# Altium schematic sheet SoftPowerSwitch.SchDoc
size A4; SheetNumber: 7; SheetTotal: 10
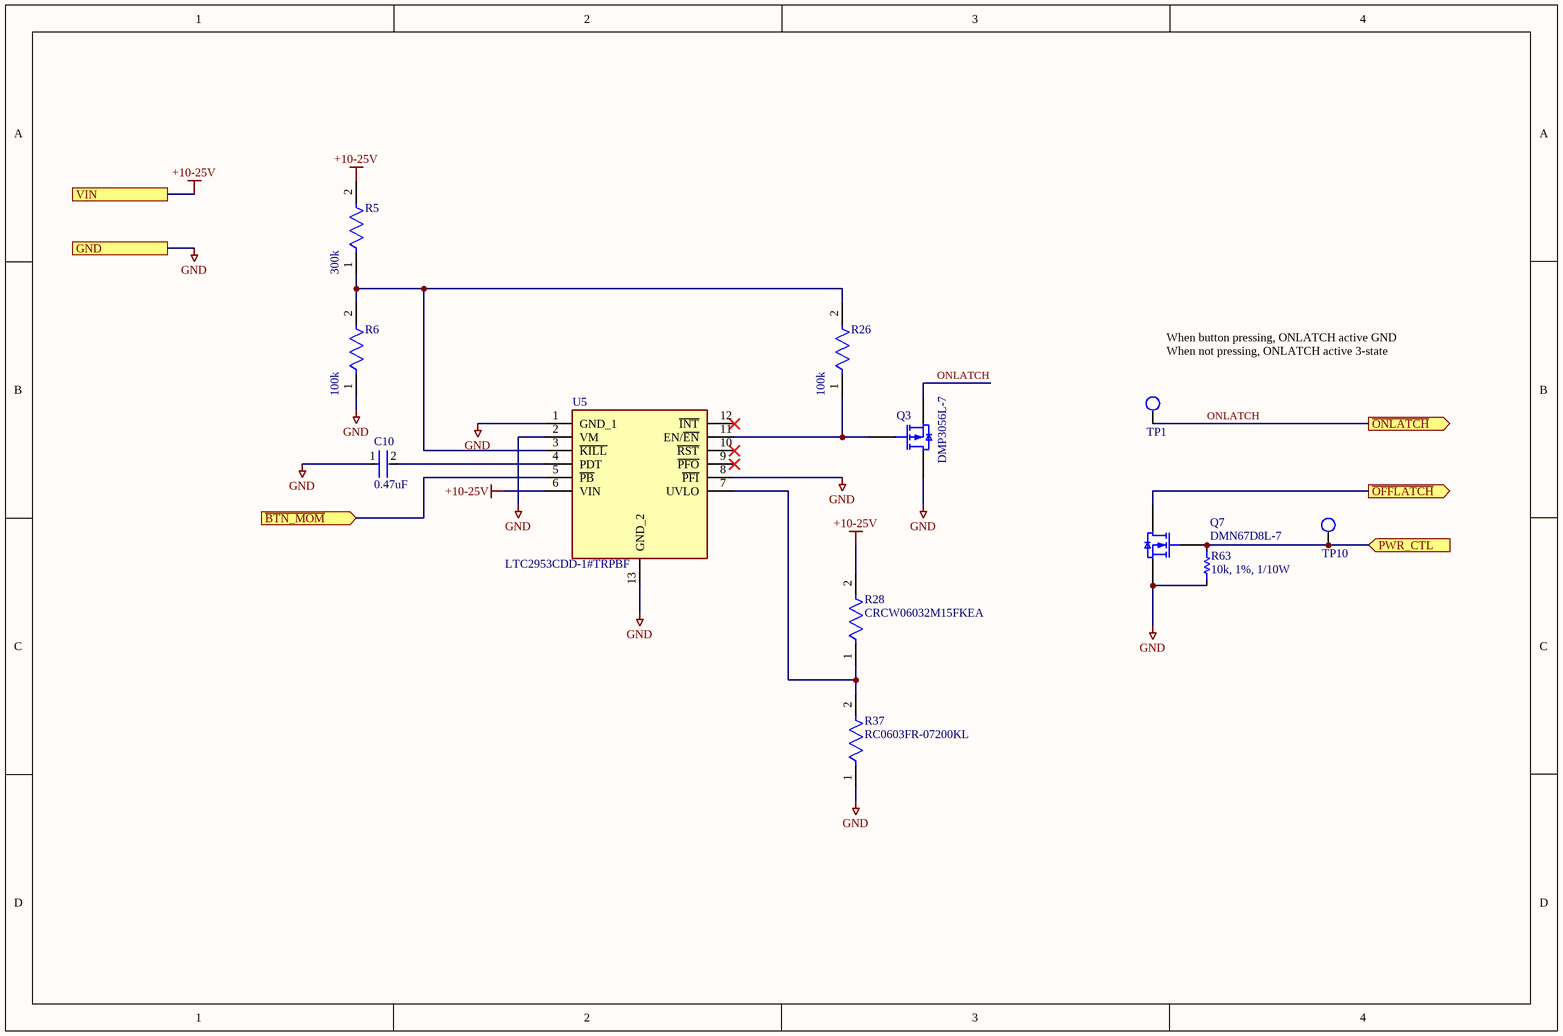
[diagram p0: SoftPowerSwitch.SchDoc]

## Parts
C10  0.47uF  [FP-C0603C-CF-MFG]
Q3  DMP3056L-7  [SOT23-3]
Q7  DMN67D8L-7  [SOT23-3]
R5  300k  [FP-ERA3A-IPC_C]
R6  100k  [FP-RC0603-0_55-MFG]
R26  100k  [FP-RC0603-0_55-MFG]
R28  CRCW06032M15FKEA  [FP-CRCW0603-e3-IPC_A]
R37  RC0603FR-07200KL  [FP-RC0603-0_55-IPC_B]
R63  10k, 1%, 1/10W  [0603]
TP1  2mm  [TEST POINT 40 Mil]  (value not drawn)  (no BOM)
TP10  2mm  [TEST POINT 40 Mil]  (value not drawn)  (no BOM)
U5  LTC2953CDD-1#TRPBF  [SON45P300X300X80-13N-D]

## Ports
GND, PWR_CTL (in), VIN, ~{BTN_MOM} (in), ~{OFFLATCH} (out), ~{ONLATCH} (out)

## Nets
+10-25V: R5.2 R28.2 U5.6(VIN) ; port VIN
GND: C10.1 Q3.3(D) Q7.2(S) R6.1 R37.1 R63.1 U5.1(GND_1) U5.2(VM) U5.8(~{PFI}) U5.13(GND_2) ; port GND
~{BTN_MOM}: U5.5(~{PB}) ; port ~{BTN_MOM}
~{OFFLATCH}: Q7.3(D) ; port ~{OFFLATCH}
ONLATCH: Q3.2(S) TP1.1(TP) ; port ~{ONLATCH}
PWR_CTL: Q7.1(G) R63.2 TP10.1(TP) ; port PWR_CTL
NetC10_2: C10.2 U5.4(PDT)
NetQ3_1: Q3.1(G) R26.1 U5.11(EN/~{EN})
NetR5_1: R5.1 R6.2 R26.2 U5.3(~{KILL})
NetR28_1: R28.1 R37.2 U5.7(UVLO)

Not connected (* = marked no-connect by the designer): U5 9(~{PFO})* 10(~{RST})* 12(~{INT})*

## Notes on the sheet
- When button pressing, ONLATCH active GND
  When not pressing, ONLATCH active 3-state

## Library data of the parts
C10 = CMP-2006-02280-3: CAP CER 0.47UF 16V 10% X5R 0603; Manufacturer Part Number: C0603C474K4PACTU; Manufacturer: KEMET; Material: Ceramic; Tolerance: 0.1; Temperature Coefficient: 30ppm/°C; Capacitance: 0.47 μF; Automotive Grade: Grade 1; Value: 0.47 μF; Temperature Range High: +125°C; ComponentLink2Description: Datasheet; Temperature Range Low: -55°C; Temperature: -55°C to +125°C; Automotive: Yes; Package: C0603C-CF; Device Class L1: Passive Components; Height: 0.87mm; Device Class L3: Ceramic Capacitors; Octopart: https://octopart.com/c0603c474k4pactu-kemet-9144082; Category: Cap; Temperature Characteristic: X5R; Mouser Description: Cap Ceramic 0.47uF 16V X5R 10% SMD 0603 85°C Paper T/R; Lead Free: Yes; Voltage Rating: 16 V; ComponentLink2URL: https://api.kemet.com/component-edge/download/datasheet/C0603C100J5GACAUTO.pdf; Device Class L2: Capacitors; Digikey Description: CAP CER 0.47UF 16V 10% X5R 0603; RoHS: TRUE
Q3 = NS00910: MOSFET P-CH 30V 4.3A SOT23; Type: IC; Part Number: NS00910; Value: DMP3056L-7; ComponentLink1Description: Datasheet; ComponentLink1URL: H:\Doc\Diodes\DMP3056L.pdf; Supplier 1: Digi-Key; Supplier Part Number 1: DMP3056L-7DICT-ND
Q7 = NS00873: MOSFET N-CH 60V 210MA SOT23; Type: IC; Published: 8-Jun-2000; LatestRevisionDate: 17-Jul-2002; LatestRevisionNote: Re-released for DXP Platform.; PackageVersion: 1995/1996; PackageReference: E3; Publisher: Altium Limited; Part Number: NS00873; Value: DMN67D8L-7; ComponentLink1Description: Datasheet; ComponentLink1URL: H:\Doc\Diodes\DMN67D8L.pdf; Supplier 1: Digi-Key; Supplier Part Number 1: DMN67D8L-7DICT-ND
R5 = CMP-2000-00028-2: RES SMD 300K OHM 0.1% 1/10W 0603; Voltage Rating (DC): 75V; Temperature Coefficient: 25ppm/°C; Resistance: 300kR; Power Rating: 100mW; Technology: THIN FILM; Case/Package: 0603; Width: 0.8mm; Contact Plating: Tin; Case Code (Imperial): 0603; Series: ERA; Construction: Rectangular; Depth: 0.8mm; Resistance Tolerance: 0.1%; Height: 0.45mm; Voltage Rating: 75V; Tolerance: 0.1%; Resistor Type: Thin Film; Max Operating Temperature: 155°C; Length: 1.6mm; Weight: 7.1E-05oz; REACH SVHC: No SVHC; Min Operating Temperature: -55°C; RoHS Compliant: Yes; Radiation Hardening: No; Mount: Surface Mount; Number of Terminations: 2; Size Code: 0603; Packaging: Tape and Reel; Case Code (Metric): 1608; Package Quantity: 5000; Military Standard: Not; Max Power Dissipation: 100mW; Lead Free: Lead Free; Number of Pins: 2; Termination: SMD/SMT; Supplier 1: Digi-Key; Supplier Part Number 1: ERA-3AEB304V
R6 R26 = CMP-2100-03662-2: RES SMD 100K OHM 1% 1/10W 0603; Voltage Rating (DC): 50V; Resistance: 100kR; Max Power Dissipation: 100mW; Temperature Coefficient: 100ppm/°C; Working Voltage: 75V; Length: 1.6mm; Lead Free: Lead Free; Number of Terminations: 2; Packaging: Tape and Reel; Voltage Rating: 50V; Termination: SMD/SMT; Width: 0.8mm; Resistor Type: Thick Film; Resistance Tolerance: 1%; Features: Moisture Resistant; Height: 0.45mm; Construction: Rectangular; Case/Package: 0603; Military Standard: Not; Case Code (Imperial): 0603; Series: RC; Technology: THICK FILM; Depth: 0.8mm; RoHS Compliant: Yes; REACH SVHC: No SVHC; Min Operating Temperature: -55°C; Case Code (Metric): 1608; Max Operating Temperature: 155°C; Power Rating: 100mW; Number of Pins: 2; Tolerance: 1%; Supplier 1: Digi-Key; Supplier Part Number 1: RC0603FR-07100KL
R28 = CMP-1012-00884-3: RES Thick Film, 2.15MΩ, 1%, 0.1W, 100ppm/°C, 0603; Resistance: 2.15MR; Voltage Rating: 75V; Max Power Dissipation: 100mW; Depth: 0.85mm; Min Operating Temperature: -55°C; Number of Pins: 2; Case Code (Metric): 1608; Radiation Hardening: No; Temperature Coefficient: 100ppm/°C; Packaging: Tape and Reel; Composition: Thick Film; Lead Free: Lead Free; Military Standard: Not; Length: 1.55mm; Weight: 7.1E-05oz; Width: 0.033inch; Termination: SMD/SMT; Package Quantity: 10; Max Operating Temperature: 155°C; Number of Terminations: 2; Contact Plating: Tin; Features: Automotive AEC-Q200; Height: 0.02inch; Case/Package: 0603; Tolerance: 1%; Power Rating: 100mW; Case Code (Imperial): 0603; Voltage Rating (DC): 75V; Supplier 1: Digi-Key; Supplier Part Number 1: CRCW06032M15FKEA
R37 = CMP-03412-037786-1: RES SMD 200K OHM 1% 1/10W 0603; Temperature Coefficient: 100ppm/°C; Voltage Rating: 50V; Resistance: 200kR; Max Power Dissipation: 100mW; Packaging: Tape and Reel; REACH SVHC: No SVHC; Resistance Tolerance: 1%; Number of Pins: 2; Width: 0.031inch; Termination: SMD/SMT; Features: Moisture Resistant; Tolerance: 1%; Series: RC; Case Code (Imperial): 0603; Depth: 0.8mm; Number of Terminations: 2; Max Operating Temperature: 155°C; Resistor Type: Thick Film; Height: 0.022inch; Lead Free: Lead Free; Construction: Rectangular; Case/Package: 0603; Power Rating: 100mW; Case Code (Metric): 1608; Length: 1.6mm; Size Code: 0603; RoHS Compliant: Yes; Military Standard: Not; Min Operating Temperature: -55°C; Package Quantity: 1; Voltage Rating (DC): 50V
R63 = NS00820: RES 10K OHM 1% 1/10W 0603; Alternatives: Generic; Part Number: NS00820; Type: R; Value: 10k, 1%, 1/10W; Supplier 1: Digi-Key; Supplier Part Number 1: RMCF0603FT10K0CT-ND
TP1 TP10 = NS00254: Testpoint 2mm round; Part Number: NS00254; Type: Mechanical; Value: 2mm
U5 = LTC2953CDD-1#PBF: Integrated Circuit; Manufacturer_Name: Analog Devices; Datasheet Link: https://www.analog.com/media/en/technical-documentation/data-sheets/2953f.pdf; Height: 0.8mm; Manufacturer_Part_Number: LTC2953CDD-1#PBF; Mouser Part Number: 584-LTC2953CDD-1#PBF; Mouser Price/Stock: https://www.mouser.com/Search/Refine.aspx?Keyword=584-LTC2953CDD-1%23PBF; Arrow Part Number: LTC2953CDD-1#PBF; Arrow Price/Stock: https://www.arrow.com/en/products/ltc2953cdd-1pbf/linear-technology; Supplier 1: Digikey; Supplier Part Number: LTC2953CDD-1#TRPBFTR-ND